# Altium schematic sheet Feedback.SchDoc: Feedback (part 1 of 2)
size Tabloid; DocumentNumber: FB-001; Revision: A; SheetNumber: 3; SheetTotal: 5
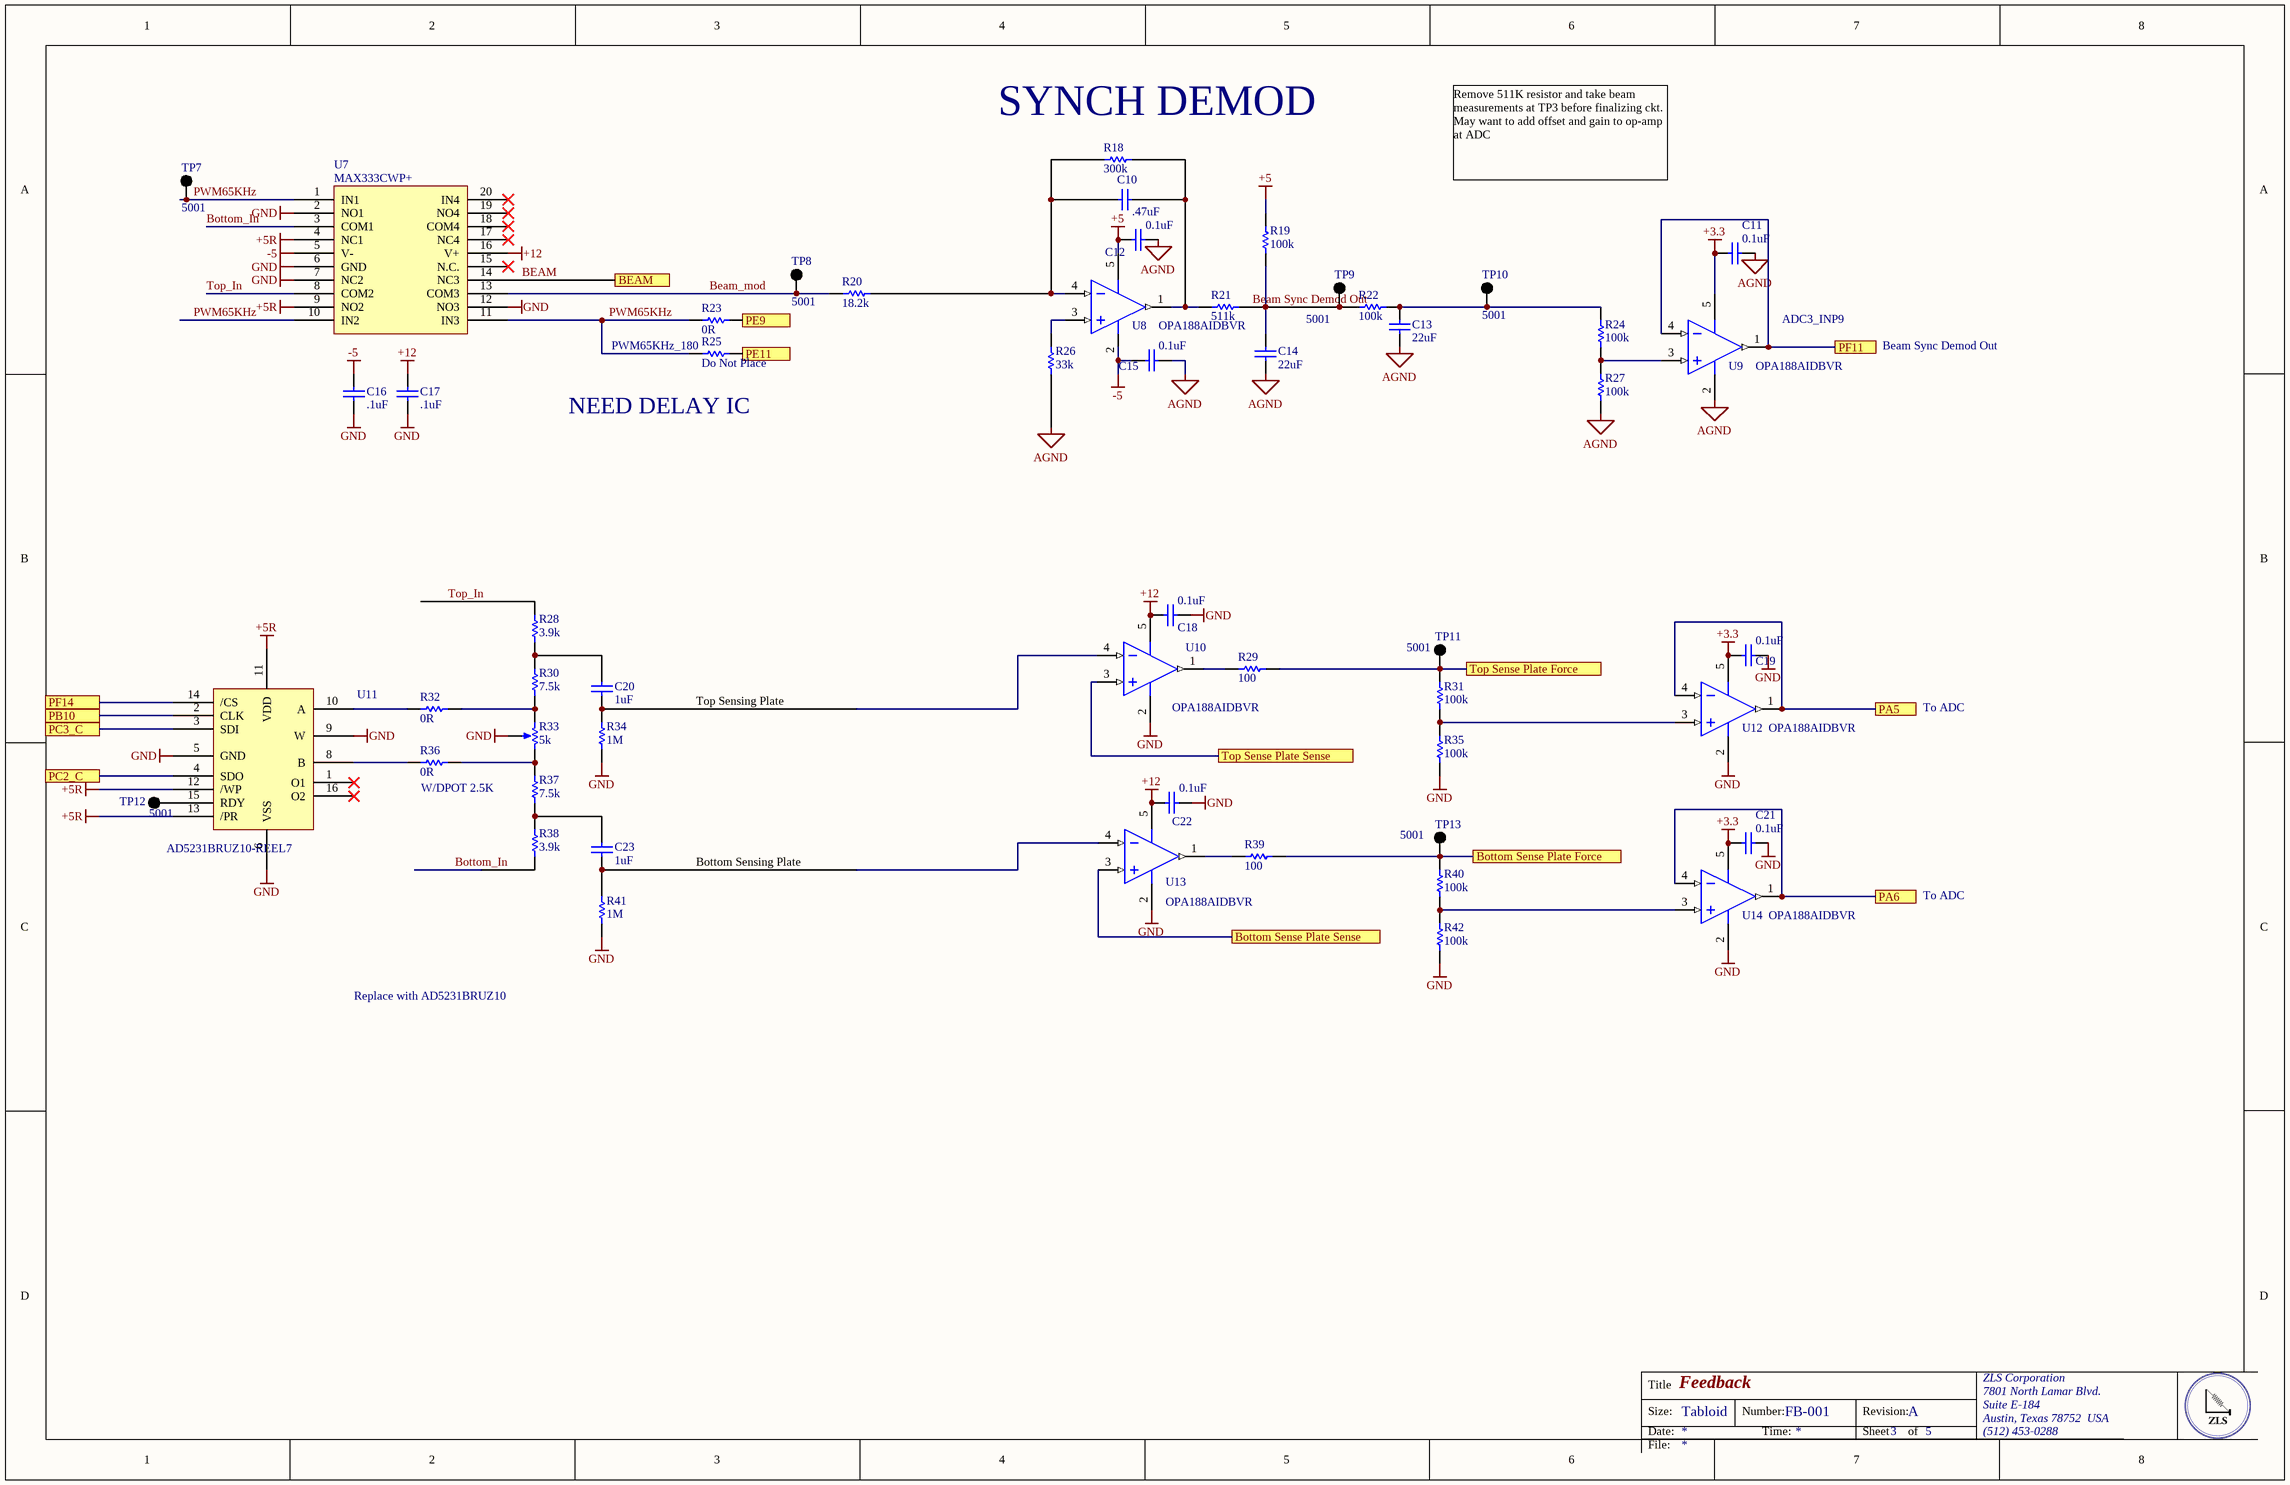
[diagram p0: Feedback.SchDoc]

## Parts
C10  .47uF  [CAPC0805(2012)75_L]
C11  0.1uF  [CAPC0402(1005)60_L]
C12  0.1uF  [CAPC0402(1005)60_L]
C13  22uF  [CAPC0805(2012)75_L]
C14  22uF  [CAPC0805(2012)75_L]
C15  0.1uF  [CAPC0402(1005)60_L]
C16  .1uF  [CAPC0805(2012)75_M]
C17  .1uF  [CAPC0805(2012)75_M]
C18  0.1uF  [CAPC0402(1005)60_L]
C19  0.1uF  [CAPC0402(1005)60_L]
C20  1uF  [CAPC0402(1005)60_L]
C21  0.1uF  [CAPC0402(1005)60_L]
C22  0.1uF  [CAPC0402(1005)60_L]
C23  1uF  [CAPC0402(1005)60_L]
R18  300k  [RESC1005X40X25LL05T05]
R19  100k  [RESC0402(1005)_M]
R20  18.2k  [RESC1005X40X25NL05T05]
R21  511k  [RESC1005X40X25ML05T05]
R22  100k  [RESC0402(1005)_M]
R23  0R  [RESC1005X40X25NL05T10]
R24  100k  [RESC0402(1005)_M]
R25  Do Not Place  [RESC1005X40X25NL05T10]
R26  33k  [RESC0402(1005)_N]
R27  100k  [RESC0402(1005)_M]
R28  3.9k  [RESC1005X40X25NL05T05]
R29  100  [RESC0402(1005)_N]
R30  7.5k  [RESC1005X40X25LL05T05]
R31  100k  [RESC0402(1005)_M]
R32  0R  [RESC1005X40X25NL05T10]
R33  Resistance (Ohms): 5k  [Trimmer 2.54]  (hidden comment: Do Not Place)
R34  1M  [RESC1005X40X25NL05T05]
R35  100k  [RESC0402(1005)_M]
R36  0R  [RESC1005X40X25NL05T10]
R37  7.5k  [RESC1005X40X25LL05T05]
R38  3.9k  [RESC1005X40X25NL05T05]
R39  100  [RESC0402(1005)_N]
R40  100k  [RESC0402(1005)_M]
R41  1M  [RESC1005X40X25NL05T05]
R42  100k  [RESC0402(1005)_M]
TP7  5001  [KSTN-5001]
TP8  5001  [KSTN-5001]
TP9  5001  [KSTN-5001]
TP10  5001  [KSTN-5001]
TP11  5001  [KSTN-5001]
TP12  5001  [KSTN-5001]
TP13  5001  [KSTN-5001]
U7  MAX333CWP+  [TSOP65P640X90-20N]
U8  OPA188AIDBVR  [DBV0005A_M]
U9  OPA188AIDBVR  [DBV0005A_M]
U10  OPA188AIDBVR  [DBV0005A_M]
U11  AD5231BRUZ10-REEL7  [AD5231BRUZ10]
U12  OPA188AIDBVR  [DBV0005A_M]
U13  OPA188AIDBVR  [DBV0005A_M]
U14  OPA188AIDBVR  [DBV0005A_M]

## Ports
BEAM, Bottom Sense Plate Force, Bottom Sense Plate Sense, PA5, PA6, PB10, PC2_C, PC3_C, PE9, PE11, PF11, PF14, Top Sense Plate Force, Top Sense Plate Sense

## Nets
+3.3: C11.2 C19.2 C21.2 U9.5(V+) U12.5(V+) U14.5(V+)
+5: C12.2 R19.2 U8.5(V+)
+5R: U7.4(NC1) U7.9(NO2) U11.11(VDD) U11.12(/WP) U11.13(/PR)
+12: C17.2 C18.2 C22.2 U7.16(V+) U10.5(V+) U13.5(V+)
-5: C15.2 C16.2 U7.5(V-) U8.2(V-)
AGND: C11.1 C12.1 C13.1 C14.1 C15.1 R26.1 R27.1 U9.2(V-)
GND: C16.1 C17.1 C18.1 C19.1 C21.1 C22.1 R33.2(b) R34.1 R35.1 R41.1 R42.1 U7.2(NO1) U7.6(GND) U7.7(NC2) U7.12(NO3) U10.2(V-) U11.5(GND) U11.6(VSS) U11.9(W) U12.2(V-) U13.2(V-) U14.2(V-)
BEAM: U7.14(NC3) ; port BEAM
Beam Sync Demod Out: C14.2 R19.1 R21.2 R22.2 TP9.1
Beam_mod: R20.1 TP8.1 U7.13(COM3)
Bottom Sense Plate Force: R39.2 R40.2 TP13.1 ; port Bottom Sense Plate Force
Bottom Sense Plate Sense: U13.3(IN+) ; port Bottom Sense Plate Sense
Bottom_In: R38.1 U7.3(COM1)
PA5: U12.1(OUT) U12.4(IN-) ; port PA5
PA6: U14.1(OUT) U14.4(IN-) ; port PA6
PB10: U11.2(CLK) ; port PB10
PC2_C: U11.4(SDO) ; port PC2_C
PC3_C: U11.3(SDI) ; port PC3_C
PE9: R23.2 ; port PE9
PE11: R25.2 ; port PE11
PF11: U9.1(OUT) U9.4(IN-) ; port PF11
PF14: U11.14(/CS) ; port PF14
PWM65KHz: R23.1 R25.1 TP7.1 U7.1(IN1) U7.10(IN2) U7.11(IN3)
Top Sense Plate Force: R29.2 R31.2 TP11.1 ; port Top Sense Plate Force
Top Sense Plate Sense: U10.3(IN+) ; port Top Sense Plate Sense
Top_In: R28.2 U7.8(COM2)
NetC10_1: C10.1 R18.1 R20.2 U8.4(IN-)
NetC10_2: C10.2 R18.2 R21.1 U8.1(OUT)
NetC13_2: C13.2 R22.1 R24.2 TP10.1
NetC20_1: C20.1 R34.2 U10.4(IN-)
NetC20_2: C20.2 R28.1 R30.2
NetC23_1: C23.1 R41.2 U13.4(IN-)
NetC23_2: C23.2 R37.1 R38.2
NetR24_1: R24.1 R27.2 U9.3(IN+)
NetR26_2: R26.2 U8.3(IN+)
NetR29_1: R29.1 U10.1(OUT)
NetR30_1: R30.1 R32.2 R33.1(a)
NetR31_1: R31.1 R35.2 U12.3(IN+)
NetR32_1: R32.1 U11.10(A)
NetR33_3: R33.3(c) R36.2 R37.2
NetR36_1: R36.1 U11.8(B)
NetR39_1: R39.1 U13.1(OUT)
NetR40_1: R40.1 R42.2 U14.3(IN+)
NetTP12_1: TP12.1 U11.15(RDY)

Not connected (* = marked no-connect by the designer): U7 15(N.C.)* 17(NC4)* 18(COM4)* 19(NO4)* 20(IN4)*; U11 1(O1)* 16(O2)*

## Notes on the sheet
- (near R18) SYNCH DEMOD
- Remove 511K resistor and take beam measurements at TP3 before finalizing ckt.
  May want to add offset and gain to op-amp at ADC
- PWM65KHz_180
- (near U9) ADC3_INP9
- Beam Sync Demod Out
- (near R25) NEED DELAY IC
- Top Sensing Plate
- To ADC
- (near R36) W/DPOT 2.5K
- Bottom Sensing Plate
- Replace with AD5231BRUZ10
- Title
- Size:
- Date:
- Tabloid
- Number:
- Time:
- Revision:
- Sheet
- of
- ZLS Corporation
- 7801 North Lamar Blvd.
- Suite E-184
- Austin, Texas 78752  USA
- (512) 453-0288
- File: